# EAGLE schematic frekvensHack_schematic (EAGLE 9.6.2)
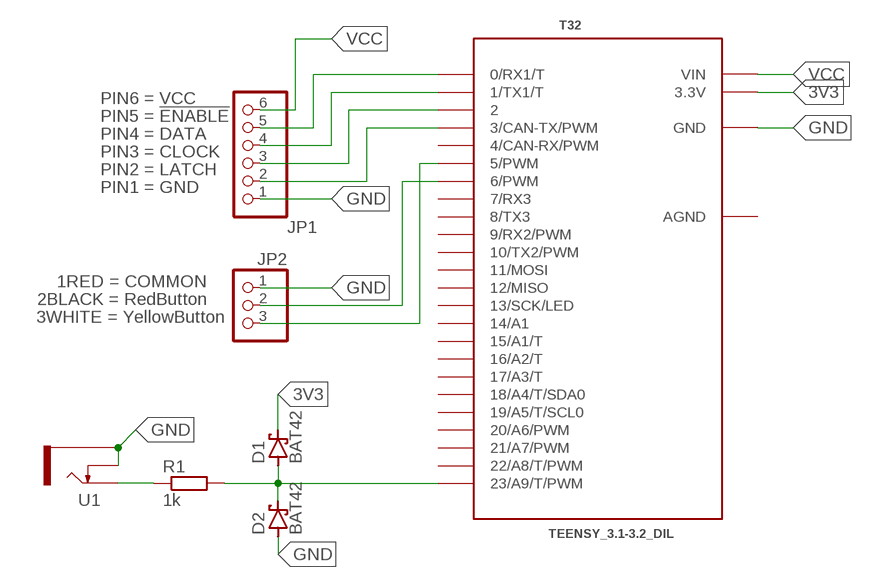
[diagram p0: schematic, sheet 1]

## Parts
D1  BAT42  [DO35-10]
D2  BAT42  [DO35-10]
JP1  PINHD-1X6  [1X06]
JP2  PINHD-1X3  [1X03]
R1  1k  RESISTOR10MM_RESISTOR  [10MM_RESISTOR]
T32  TEENSY_3.1-3.2_DIL  [TEENSY_3.0-3.2&LC_DIL]
U1  THONKICONNNEW  [WQP-PJ301M-12_JACK]

## Nets
3V3: D1.C T32.3.3V
GND: D2.A JP1.1 JP2.1 T32.GND U1.P$2_SWITCH(SWITCH) U1.P$3_SLEEVE(SLEEVE)
N$1: JP1.5 T32.0(0/RX1/T)
N$2: JP1.4 T32.1(1/TX1/T)
N$3: JP1.3 T32.2
N$4: JP1.2 T32.3(3/CAN-TX/PWM)
N$5: JP2.3 T32.5(5/PWM)
N$6: JP2.2 T32.6(6/PWM)
N$7: D1.A D2.C R1.2 T32.23/A9(23/A9/T/PWM)
N$8: R1.1 U1.P$1_TIP(TIP)
VCC: JP1.6 T32.VIN
Unconnected: T32.4(4/CAN-RX/PWM) T32.7(7/RX3) T32.8(8/TX3) T32.9(9/RX2/PWM) T32.10(10/TX2/PWM) T32.11(11/MOSI) T32.12(12/MISO) T32.13(13/SCK/LED) T32.14/A0(14/A1) T32.15/A1(15/A1/T) T32.16/A2(16/A2/T) T32.17/A3(17/A3/T) T32.18/A4(18/A4/T/SDA0) T32.19/A5(19/A5/T/SCL0) T32.20/A6(20/A6/PWM) T32.21/A7(21/A7/PWM) T32.22/A8(22/A8/T/PWM)

## Power pins joined to a net without a drawn wire
AGND: T32.AGND

## Library data of the parts
D1 D2 = diode:BAT42: DIODE barrier diode
JP1 = adafruit:PINHD-1X6: PIN HEADER; PIN1: GND; PIN2: LATCH; PIN3: CLOCK; PIN4: DATA; PIN5: !ENABLE; PIN6: VCC
JP2 = adafruit:PINHD-1X3: PIN HEADER; 1RED: COMMON; 2BLACK: RedButton; 3WHITE: YellowButton
R1 = MusicThingModular:RESISTOR: Standard resistor, various versions
T32 = Teensy_3_and_LC_Series_Boards_v1.4:TEENSY_3.1-3.2_DIL: Teensy 3.1 or 3.2 in a DIL Layout.
U1 = MusicThingModular:THONKICONN: 3.5mm socket for Eurorack modular synths